# Altium schematic sheet 01_sensors.SchDoc: SENSEI Sensor Shield - Sensors
size A2; Author: Philip Wiese; DrawnBy: Philip Wiese; Engineer: Philip Wiese; Organization: Integrated System Laboratory; DocumentNumber: 1; Revision: v1.0; SheetNumber: 1; SheetTotal: 4
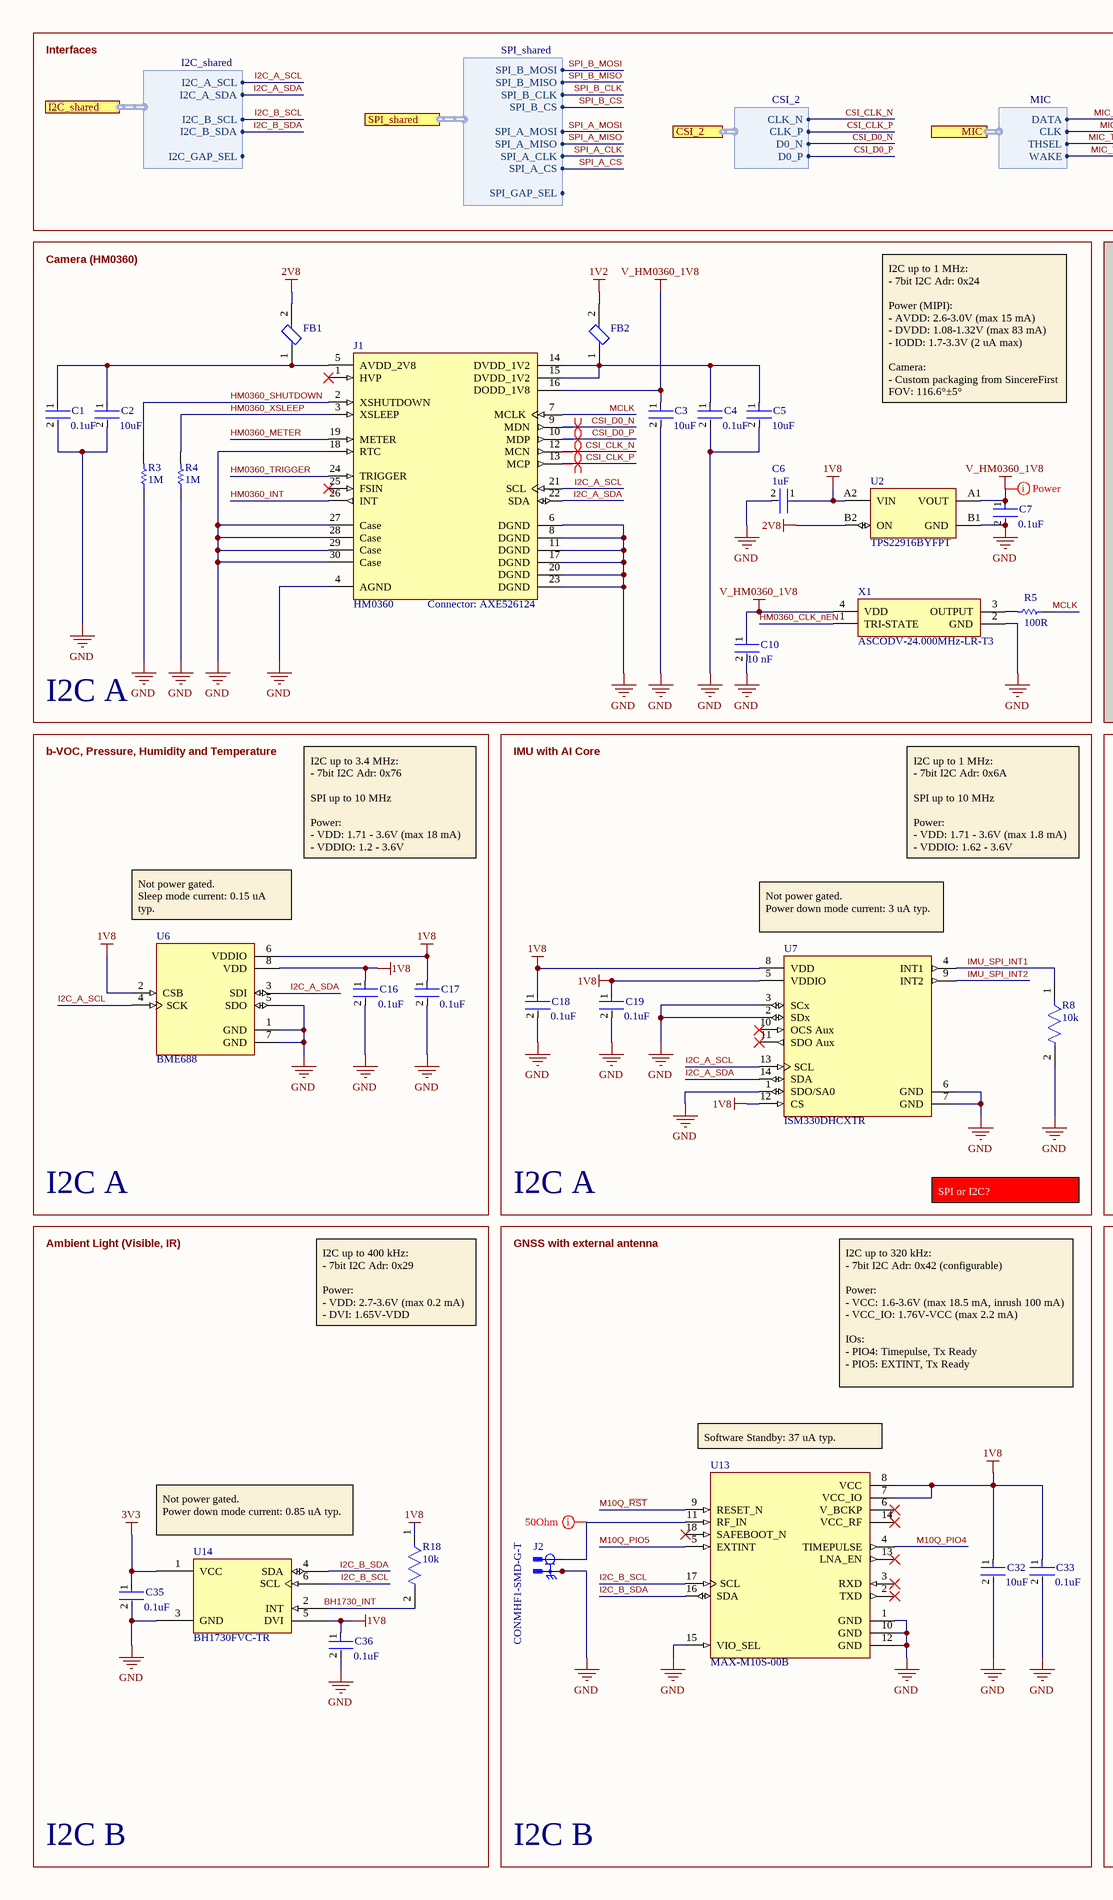
[diagram p0: 01_sensors.SchDoc, left]
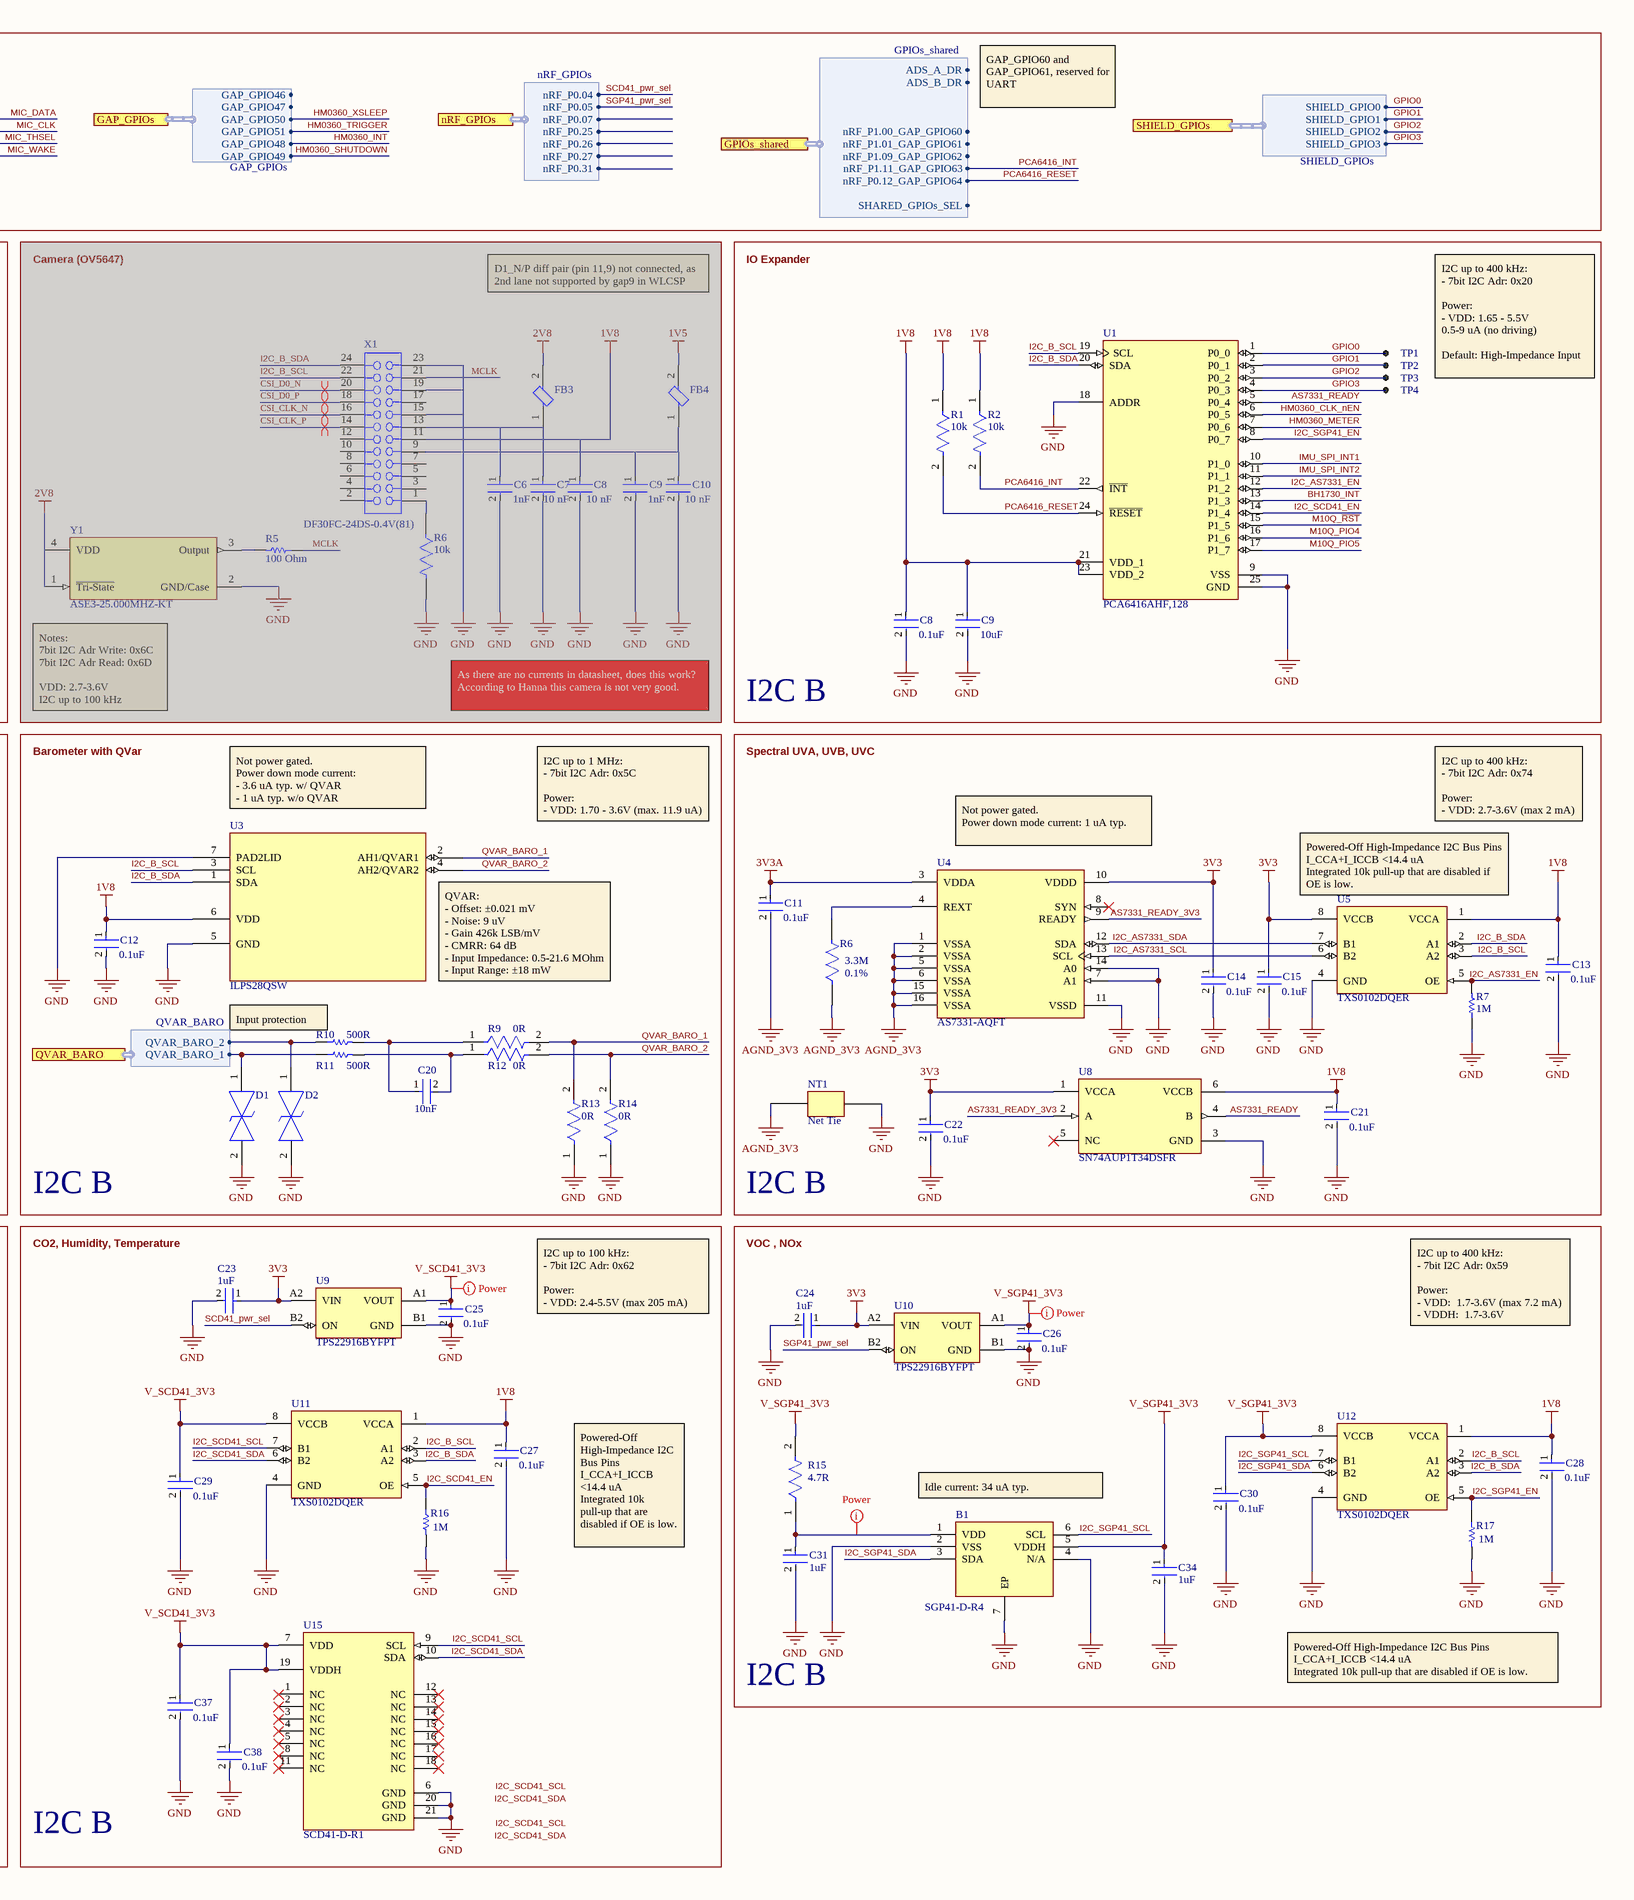
[diagram p1: 01_sensors.SchDoc, right]

## Parts
(Parts that share a designator on the sheet are numbered #1, #2 ... from top to bottom, then left to right.)
B1  SGP41-D-R4  [SON80P244X244X95-7N]
C1  Capacitance: 0.1uF  [FP-GRM033-0_03-IPC_B]  (hidden comment: GRM033Z71C104KE14D)
C2  Capacitance: 10uF  [FP-GRM155-0_2-0_1-MFG]  (hidden comment: GRM155R60G106ME47D)
C3  Capacitance: 10uF  [FP-GRM155-0_2-0_1-MFG]  (hidden comment: GRM155R60G106ME47D)
C4  Capacitance: 0.1uF  [FP-GRM033-0_03-IPC_B]  (hidden comment: GRM033Z71C104KE14D)
C5  Capacitance: 10uF  [FP-GRM155-0_2-0_1-MFG]  (hidden comment: GRM155R60G106ME47D)
C6#1  value 1nF  [FP-GRM155-0_05-IPC_B]  (hidden comment: C0402C102F5GECAUTO)  (masked out: inside a compile mask, not in the netlist)
C6#2  Capacitance: 1uF  [FP-CL03-IPC_B]  (hidden comment: CL03A105KP3NSNC)
C7#1  Capacitance: 10 nF  [FP-CC0402-MFG]  (hidden comment: CC0402KRX7R7BB103)  (masked out: inside a compile mask, not in the netlist)
C7#2  Capacitance: 0.1uF  [FP-GRM033-0_03-IPC_B]  (hidden comment: GRM033Z71C104KE14D)
C8#1  Capacitance: 10 nF  [FP-CC0402-MFG]  (hidden comment: CC0402KRX7R7BB103)  (masked out: inside a compile mask, not in the netlist)
C8#2  Capacitance: 0.1uF  [FP-GRM033-0_03-IPC_B]  (hidden comment: GRM033Z71C104KE14D)
C9#1  value 1nF  [FP-GRM155-0_05-IPC_B]  (hidden comment: C0402C102F5GECAUTO)  (masked out: inside a compile mask, not in the netlist)
C9#2  Capacitance: 10uF  [FP-GRM155-0_2-0_1-MFG]  (hidden comment: GRM155R60G106ME47D)
C10#1  Capacitance: 10 nF  [FP-CC0402-MFG]  (hidden comment: CC0402KRX7R7BB103)  (masked out: inside a compile mask, not in the netlist)
C10#2  Capacitance: 10 nF  [FP-CC0402-MFG]  (hidden comment: CC0402KRX7R7BB103)
C11  Capacitance: 0.1uF  [FP-GRM033-0_03-IPC_B]  (hidden comment: GRM033Z71C104KE14D)
C12  Capacitance: 0.1uF  [FP-GRM033-0_03-IPC_B]  (hidden comment: GRM033Z71C104KE14D)
C13  Capacitance: 0.1uF  [FP-GRM033-0_03-IPC_B]  (hidden comment: GRM033Z71C104KE14D)
C14  Capacitance: 0.1uF  [FP-GRM033-0_03-IPC_B]  (hidden comment: GRM033Z71C104KE14D)
C15  Capacitance: 0.1uF  [FP-GRM033-0_03-IPC_B]  (hidden comment: GRM033Z71C104KE14D)
C16  Capacitance: 0.1uF  [FP-GRM033-0_03-IPC_B]  (hidden comment: GRM033Z71C104KE14D)
C17  Capacitance: 0.1uF  [FP-GRM033-0_03-IPC_B]  (hidden comment: GRM033Z71C104KE14D)
C18  Capacitance: 0.1uF  [FP-GRM033-0_03-IPC_B]  (hidden comment: GRM033Z71C104KE14D)
C19  Capacitance: 0.1uF  [FP-GRM033-0_03-IPC_B]  (hidden comment: GRM033Z71C104KE14D)
C20  Capacitance: 10nF  [FP-GRM033-0_03-IPC_A]  (hidden comment: GRM033R71A103JA01D)
C21  Capacitance: 0.1uF  [FP-GRM033-0_03-IPC_B]  (hidden comment: GRM033Z71C104KE14D)
C22  Capacitance: 0.1uF  [FP-GRM033-0_03-IPC_B]  (hidden comment: GRM033Z71C104KE14D)
C23  Capacitance: 1uF  [FP-CL03-IPC_B]  (hidden comment: CL03A105KP3NSNC)
C24  Capacitance: 1uF  [FP-CL03-IPC_B]  (hidden comment: CL03A105KP3NSNC)
C25  Capacitance: 0.1uF  [FP-GRM033-0_03-IPC_B]  (hidden comment: GRM033Z71C104KE14D)
C26  Capacitance: 0.1uF  [FP-GRM033-0_03-IPC_B]  (hidden comment: GRM033Z71C104KE14D)
C27  Capacitance: 0.1uF  [FP-GRM033-0_03-IPC_B]  (hidden comment: GRM033Z71C104KE14D)
C28  Capacitance: 0.1uF  [FP-GRM033-0_03-IPC_B]  (hidden comment: GRM033Z71C104KE14D)
C29  Capacitance: 0.1uF  [FP-GRM033-0_03-IPC_B]  (hidden comment: GRM033Z71C104KE14D)
C30  Capacitance: 0.1uF  [FP-GRM033-0_03-IPC_B]  (hidden comment: GRM033Z71C104KE14D)
C31  Capacitance: 1uF  [FP-CL03-IPC_B]  (hidden comment: CL03A105KP3NSNC)
C32  Capacitance: 10uF  [FP-GRM155-0_2-0_1-MFG]  (hidden comment: GRM155R60G106ME47D)
C33  Capacitance: 0.1uF  [FP-GRM033-0_03-IPC_B]  (hidden comment: GRM033Z71C104KE14D)
C34  Capacitance: 1uF  [FP-CL03-IPC_B]  (hidden comment: CL03A105KP3NSNC)
C35  Capacitance: 0.1uF  [FP-GRM033-0_03-IPC_B]  (hidden comment: GRM033Z71C104KE14D)
C36  Capacitance: 0.1uF  [FP-GRM033-0_03-IPC_B]  (hidden comment: GRM033Z71C104KE14D)
C37  Capacitance: 0.1uF  [FP-GRM033-0_03-IPC_B]  (hidden comment: GRM033Z71C104KE14D)
C38  Capacitance: 0.1uF  [FP-GRM033-0_03-IPC_B]  (hidden comment: GRM033Z71C104KE14D)
D1  TPD1E01B04DPYRQ1  [TPD1E01B04DPYRQ1]  (value not drawn)
D2  TPD1E01B04DPYRQ1  [TPD1E01B04DPYRQ1]  (value not drawn)
FB1  BLM18HE152SN1D  [FP-BLM18-0_15-t0_8-IPC_C]  (value not drawn)
FB2  BLM18HE152SN1D  [FP-BLM18-0_15-t0_8-IPC_C]  (value not drawn)
FB3  BLM18HE152SN1D  [FP-BLM18-0_15-t0_8-IPC_C]  (value not drawn)  (masked out: inside a compile mask, not in the netlist)
FB4  BLM18HE152SN1D  [FP-BLM18-0_15-t0_8-IPC_C]  (value not drawn)  (masked out: inside a compile mask, not in the netlist)
J1  Connector: AXE526124  [AXE526124_HM0360]
J2  CONMHF1-SMD-G-T  [LINX_CONMHF1-SMD-G-T]
NT1  Net Tie  [Net_Tie_Top_Bottom0_4mm_0_2mm]  (net tie, no BOM)
R1  Resistance: 10k  [FP-RMCF0201-IPC_C]  (hidden comment: RMCF0201FT10K0)
R2  Resistance: 10k  [FP-RMCF0201-IPC_C]  (hidden comment: RMCF0201FT10K0)
R3  value 1M  [RESC0201(0603)_L]  (hidden comment: 1M 5% 0201(0603))
R4  value 1M  [RESC0201(0603)_L]  (hidden comment: 1M 5% 0201(0603))
R5#1  value 100 Ohm  [RESC1005X40X25LL05T05]  (hidden comment: ERJ-2RKF1000X)  (masked out: inside a compile mask, not in the netlist)
R5#2  Resistance: 100R  [RESC1005X40X25LL05T05]  (hidden comment: ERJ-2RKF1000X)
R6#1  Resistance: 10k  [FP-RMCF0201-IPC_C]  (hidden comment: RMCF0201FT10K0)  (masked out: inside a compile mask, not in the netlist)
R6#2  Resistance: 3.3M  Tolerance: 0.1%  [RESC2012X62N]  (hidden comment: MCU0805MD3304BP500)
R7  value 1M  [RESC0201(0603)_L]  (hidden comment: 1M 5% 0201(0603))
R8  Resistance: 10k  [FP-RMCF0201-IPC_C]  (hidden comment: RMCF0201FT10K0)
R9  Resistance: 0R  [FP-RMCF0402-IPC_A]  (hidden comment: RMCF0402ZT0R00)
R10  Resistance: 500R  [RESC0603X26X15LL03T05]  (hidden comment: ERJ-1GNF4990C)
R11  Resistance: 500R  [RESC0603X26X15LL03T05]  (hidden comment: ERJ-1GNF4990C)
R12  Resistance: 0R  [FP-RMCF0402-IPC_A]  (hidden comment: RMCF0402ZT0R00)
R13  Resistance: 0R  [FP-RMCF0402-IPC_A]  (hidden comment: RMCF0402ZT0R00)
R14  Resistance: 0R  [FP-RMCF0402-IPC_A]  (hidden comment: RMCF0402ZT0R00)
R15  Resistance: 4.7R  [FP-CRCW0402-e3-MFG]  (hidden comment: CRCW04024R70FKED)
R16  value 1M  [RESC0201(0603)_L]  (hidden comment: 1M 5% 0201(0603))
R17  value 1M  [RESC0201(0603)_L]  (hidden comment: 1M 5% 0201(0603))
R18  Resistance: 10k  [FP-RMCF0201-IPC_C]  (hidden comment: RMCF0201FT10K0)
TP1  Test Pad  [Pad-0.6mm]  (value not drawn)  (no BOM)
TP2  Test Pad  [Pad-0.6mm]  (value not drawn)  (no BOM)
TP3  Test Pad  [Pad-0.6mm]  (value not drawn)  (no BOM)
TP4  Test Pad  [Pad-0.6mm]  (value not drawn)  (no BOM)
U1  PCA6416AHF,128  [QFN50P400X400X80-25N-D]
U2  TPS22916BYFPT  [BGA4C40P2X2_77X77X50]
U3  ILPS28QSW  [LGA7_ILPS28_STM]
U4  AS7331-AQFT  [OLGA16]
U5  TXS0102DQER  [FP-DQE0008A-MFG]
U6  BME688  [IC_BME688]
U7  ISM330DHCXTR  [FP-LGA-14L-DM00249496-MFG]
U8  SN74AUP1T34DSFR  [FP-DSF0006A-MFG]
U9  TPS22916BYFPT  [BGA4C40P2X2_77X77X50]
U10  TPS22916BYFPT  [BGA4C40P2X2_77X77X50]
U11  TXS0102DQER  [FP-DQE0008A-MFG]
U12  TXS0102DQER  [FP-DQE0008A-MFG]
U13  MAX-M10S-00B  [XCVR_MAX-M8C-0-10]
U14  BH1730FVC-TR  [SON_30FVC-TR_ROM]
U15  SCD41-D-R1  [FP-SCD41-D-R1-MFG]
X1#1  DF30FC-24DS-0.4V(81)  [DF30FC-24DS-0.4V(81)]  (masked out: inside a compile mask, not in the netlist)
X1#2  ASCODV-24.000MHz-LR-T3  [ASCODV24000MHzLRT3]
Y1  ASE3-25.000MHZ-KT  [FP-ASE3-MFG]  (masked out: inside a compile mask, not in the netlist)

## Blocks framed on the sheet
I2C A: C1-C5 C6#2 C7#2 C10#2 FB1 FB2 J1 R3 R4 R5#2 U2 X1#2
Camera (OV5647): C6#1 C7#1 C8#1 C9#1 C10#1 FB3 FB4 R5#1 R6#1 X1#1 Y1
I2C B: C8#2 C9#2 R1 R2 TP1-TP4 U1
I2C A: C16 C17 U6
I2C A: C18 C19 R8 U7
I2C B: C12 C20 D1 D2 R9-R14 U3
I2C B: C11 C13-C15 C21 C22 NT1 R6#2 R7 U4 U5 U8
I2C B: C35 C36 R18 U14
I2C B: C32 C33 J2 U13
I2C B: C23 C25 C27 C29 C37 C38 R16 U9 U11 U15
I2C B: B1 C24 C26 C28 C30 C31 C34 R15 R17 U10 U12

## Ports
CSI_2 (harness CSI_2), GAP_GPIOs (harness GAP_GPIOs), GPIOs_shared (harness GPIOs_shared), I2C_shared (harness I2C_shared), MIC (harness MIC), nRF_GPIOs (harness nRF_GPIOs), QVAR_BARO (harness QVAR_BARO), SHIELD_GPIOs (harness SHIELD_GPIOs), SPI_shared (harness SPI_shared)

## Harnesses
I2C_shared: I2C_A_SCL, I2C_A_SDA, I2C_B_SCL, I2C_B_SDA, I2C_GAP_SEL
SPI_shared: SPI_B_MOSI, SPI_B_MISO, SPI_B_CLK, SPI_B_CS, SPI_A_MOSI, SPI_A_MISO, SPI_A_CLK, SPI_A_CS, SPI_GAP_SEL
MIC: DATA, THSEL, WAKE, CLK
CSI_2: CLK_N, CLK_P, D0_P, D0_N
GAP_GPIOs: GAP_GPIO46, GAP_GPIO47, GAP_GPIO50, GAP_GPIO51, GAP_GPIO48, GAP_GPIO49
nRF_GPIOs: nRF_P0.07, nRF_P0.25, nRF_P0.05, nRF_P0.04, nRF_P0.26, nRF_P0.27, nRF_P0.31
GPIOs_shared: ADS_A_DR, ADS_B_DR, nRF_P1.00_GAP_GPIO60, nRF_P1.09_GAP_GPIO62, nRF_P1.11_GAP_GPIO63, nRF_P0.12_GAP_GPIO64, SHARED_GPIOs_SEL, nRF_P1.01_GAP_GPIO61
QVAR_BARO: QVAR_BARO_2, QVAR_BARO_1
SHIELD_GPIOs: SHIELD_GPIO1, SHIELD_GPIO2, SHIELD_GPIO0, SHIELD_GPIO3

## Nets
1V2: FB2.2
1V8: C6#2.1 C8#2.1 C9#2.1 C12.1 C13.1 C16.1 C17.1 C18.1 C19.1 C21.1 C27.1 C28.1 C32.1 C33.1 C36.1 R1.1 R2.1 R18.1 U1.21(VDD_1) U1.23(VDD_2) U2.A2(VIN) U3.6(VDD) U5.1(VCCA) U6.2(CSB) U6.6(VDDIO) U6.8(VDD) U7.5(VDDIO) U7.8(VDD) U7.12(CS) U8.6(VCCB) U11.1(VCCA) U12.1(VCCA) U13.7(VCC_IO) U13.8(VCC) U14.5(DVI)
2V8: FB1.2 U2.B2(ON)
3V3: C14.1 C15.1 C22.1 C23.1 C24.1 C35.1 U4.10(VDDD) U5.8(VCCB) U8.1(VCCA) U9.A2(VIN) U10.A2(VIN) U14.1(VCC)
3V3A: C11.1 U4.3(VDDA)
AGND_3V3: C11.2 NT1.1 R6#2.1 U4.1(VSSA) U4.2(VSSA) U4.5(VSSA) U4.6(VSSA) U4.15(VSSA) U4.16(VSSA)
GND: B1.2(VSS) B1.4(N/A) B1.7(EP) C1.2 C2.2 C3.2 C4.2 C5.2 C6#2.2 C7#2.2 C8#2.2 C9#2.2 C10#2.2 C12.2 C13.2 C14.2 C15.2 C16.2 C17.2 C18.2 C19.2 C21.2 C22.2 C23.2 C24.2 C25.2 C26.2 C27.2 C28.2 C29.2 C30.2 C31.2 C32.2 C33.2 C34.2 C35.2 C36.2 C37.2 C38.2 D1.2 D2.2 J1.4(AGND) J1.6(DGND) J1.8(DGND) J1.11(DGND) J1.17(DGND) J1.18(RTC) J1.20(DGND) J1.23(DGND) J1.27(Case) J1.28(Case) J1.29(Case) J1.30(Case) J2.S1 J2.S2 J2.S3 NT1.2 R3.1 R4.1 R7.1 R8.2 R13.1 R14.1 R16.2 R17.2 U1.9(VSS) U1.18(ADDR) U1.25(GND) U2.B1(GND) U3.5(GND) U3.7(PAD2LID) U4.7(A1) U4.11(VSSD) U4.14(A0) U5.4(GND) U6.1(GND) U6.5(SDO) U6.7(GND) U7.1(SDO/SA0) U7.2(SDx) U7.3(SCx) U7.6(GND) U7.7(GND) U8.3(GND) U9.B1(GND) U10.B1(GND) U11.4(GND) U12.4(GND) U13.1(GND) U13.10(GND) U13.12(GND) U13.15(VIO_SEL) U14.3(GND) U15.6(GND) U15.20(GND) U15.21(GND) X1#2.2(GND)
V_HM0360_1V8: C3.1 C7#2.1 C10#2.1 J1.16(DODD_1V8) U2.A1(VOUT) X1#2.4(VDD)
V_SCD41_3V3: C25.1 C29.1 C37.1 C38.1 U9.A1(VOUT) U11.8(VCCB) U15.7(VDD) U15.19(VDDH)
V_SGP41_3V3: B1.5(VDDH) C26.1 C30.1 C34.1 R15.2 U10.A1(VOUT) U12.8(VCCB)
AS7331_READY: U1.5(P0_4) U8.4(B)
AS7331_READY_3V3: U4.9(READY) U8.2(A)
BH1730_INT: R18.2 U1.13(P1_3) U14.2(INT)
CSI_CLK_N: J1.12(MCN) ; port CSI_2.CLK_N
CSI_CLK_P: J1.13(MCP) ; port CSI_2.CLK_P
CSI_D0_N: J1.9(MDN) ; port CSI_2.D0_N
CSI_D0_P: J1.10(MDP) ; port CSI_2.D0_P
GPIO0: TP1.1 U1.1(P0_0) ; port SHIELD_GPIOs.SHIELD_GPIO0
GPIO1: TP2.1 U1.2(P0_1) ; port SHIELD_GPIOs.SHIELD_GPIO1
GPIO2: TP3.1 U1.3(P0_2) ; port SHIELD_GPIOs.SHIELD_GPIO2
GPIO3: TP4.1 U1.4(P0_3) ; port SHIELD_GPIOs.SHIELD_GPIO3
HM0360_CLK_nEN: U1.6(P0_5) X1#2.1(TRI-STATE)
HM0360_INT: J1.26(INT) ; port GAP_GPIOs.GAP_GPIO48
HM0360_METER: J1.19(METER) U1.7(P0_6)
HM0360_SHUTDOWN: J1.2(XSHUTDOWN) R3.2 ; port GAP_GPIOs.GAP_GPIO49
HM0360_TRIGGER: J1.24(TRIGGER) ; port GAP_GPIOs.GAP_GPIO51
HM0360_XSLEEP: J1.3(XSLEEP) R4.2 ; port GAP_GPIOs.GAP_GPIO50
I2C_A_SCL: J1.21(SCL) U6.4(SCK) U7.13(SCL) ; port I2C_shared.I2C_A_SCL
I2C_A_SDA: J1.22(SDA) U6.3(SDI) U7.14(SDA) ; port I2C_shared.I2C_A_SDA
I2C_AS7331_EN: R7.2 U1.12(P1_2) U5.5(OE)
I2C_AS7331_SCL: U4.13(SCL) U5.6(B2)
I2C_AS7331_SDA: U4.12(SDA) U5.7(B1)
I2C_B_SCL: U1.19(SCL) U3.3(SCL) U5.3(A2) U11.2(A1) U12.2(A1) U13.17(SCL) U14.6(SCL) ; port I2C_shared.I2C_B_SCL
I2C_B_SDA: U1.20(SDA) U3.1(SDA) U5.2(A1) U11.3(A2) U12.3(A2) U13.16(SDA) U14.4(SDA) ; port I2C_shared.I2C_B_SDA
I2C_SCD41_EN: R16.1 U1.14(P1_4) U11.5(OE)
I2C_SCD41_SCL: U11.7(B1) U15.9(SCL)
I2C_SCD41_SDA: U11.6(B2) U15.10(SDA)
I2C_SGP41_EN: R17.1 U1.8(P0_7) U12.5(OE)
I2C_SGP41_SCL: B1.6(SCL) U12.7(B1)
I2C_SGP41_SDA: B1.3(SDA) U12.6(B2)
IMU_SPI_INT1: R8.1 U1.10(P1_0) U7.4(INT1)
IMU_SPI_INT2: U1.11(P1_1) U7.9(INT2)
M10Q_PIO4: U1.16(P1_6) U13.4(TIMEPULSE)
M10Q_PIO5: U1.17(P1_7) U13.5(EXTINT)
M10Q_~{RST}: U1.15(P1_5) U13.9(RESET_N)
MCLK: J1.7(MCLK) R5#2.1
MIC_CLK: port MIC.CLK
MIC_DATA: port MIC.DATA
MIC_THSEL: port MIC.THSEL
MIC_WAKE: port MIC.WAKE
PCA6416_INT: R2.2 U1.22(~{INT}) ; port GPIOs_shared.nRF_P1.11_GAP_GPIO63
PCA6416_RESET: R1.2 U1.24(~{RESET}) ; port GPIOs_shared.nRF_P0.12_GAP_GPIO64
QVAR_BARO_1: R9.2 R13.2 U3.2(AH1/QVAR1)
QVAR_BARO_2: R12.2 R14.2 U3.4(AH2/QVAR2)
SCD41_pwr_sel: U9.B2(ON) ; port nRF_GPIOs.nRF_P0.04
SGP41_pwr_sel: U10.B2(ON) ; port nRF_GPIOs.nRF_P0.05
SPI_A_CLK: port SPI_shared.SPI_A_CLK
SPI_A_CS: port SPI_shared.SPI_A_CS
SPI_A_MISO: port SPI_shared.SPI_A_MISO
SPI_A_MOSI: port SPI_shared.SPI_A_MOSI
SPI_B_CLK: port SPI_shared.SPI_B_CLK
SPI_B_CS: port SPI_shared.SPI_B_CS
SPI_B_MISO: port SPI_shared.SPI_B_MISO
SPI_B_MOSI: port SPI_shared.SPI_B_MOSI
NetB1_1: B1.1(VDD) C31.1 R15.1
NetC1_1: C1.1 C2.1 FB1.1 J1.5(AVDD_2V8)
NetC4_1: C4.1 C5.1 FB2.1 J1.14(DVDD_1V2) J1.15(DVDD_1V2)
NetC20_1: C20.1 R9.1 R10.2
NetC20_2: C20.2 R11.2 R12.1
NetD1_1: D1.1 R11.1 ; port QVAR_BARO.QVAR_BARO_1
NetD2_1: D2.1 R10.1 ; port QVAR_BARO.QVAR_BARO_2
NetJ2_1: J2.1 U13.11(RF_IN)
NetR5#2_2: R5#2.2 X1#2.3(OUTPUT)
NetR6#2_2: R6#2.2 U4.4(REXT)

Not connected (* = marked no-connect by the designer): J1 1(HVP)* 25(FSIN)*; U4 8(SYN)*; U7 10(OCS_Aux)* 11(SDO_Aux)*; U8 5(NC)*; U13 2(TXD)* 3(RXD)* 6(V_BCKP)* 13(LNA_EN)* 14(VCC_RF)* 18(SAFEBOOT_N)*; U15 1(NC)* 2(NC)* 3(NC)* 4(NC)* 5(NC)* 8(NC)* 11(NC)* 12(NC)* 13(NC)* 14(NC)* 15(NC)* 16(NC)* 17(NC)* 18(NC)*

## Layout directives
differential pair: (no net found under the mark)
differential pair; differential pair class 100Ohm: CSI_CLK_N, CSI_CLK_P, CSI_D0_N, CSI_D0_P
rule Routing Corners [Style = Round    Min Setback = 100mil    Max Setback = 100mil]; net class 50Ohm: NetJ2_1
net class Power: NetB1_1, V_HM0360_1V8, V_SCD41_3V3, V_SGP41_3V3

## Notes on the sheet
- Interfaces
- GAP_GPIO60 and GAP_GPIO61, reserved for UART
- Camera (HM0360)
- IO Expander
- D1_N/P diff pair (pin 11,9) not connected, as 2nd lane not supported by gap9 in WLCSP
- I2C up to 1 MHz:
  - 7bit I2C Adr: 0x24
  Power (MIPI):
  - AVDD: 2.6-3.0V (max 15 mA)
  - DVDD: 1.08-1.32V (max 83 mA)
  - IODD: 1.7-3.3V (2 uA max)
  Camera:
  - Custom packaging from SincereFirst
  FOV: 116.6°±5°
- I2C up to 400 kHz:
  - 7bit I2C Adr: 0x20
  Power:
  - VDD: 1.65 - 5.5V
  0.5-9 uA (no driving)
  Default: High-Impedance Input
- (near Y1) Notes:
  7bit I2C Adr Write: 0x6C
  7bit I2C Adr Read: 0x6D
  VDD: 2.7-3.6V
  I2C up to 100 kHz
- As there are no currents in datasheet, does this work?
  According to Hanna this camera is not very good.
- b-VOC, Pressure, Humidity and Temperature
- IMU with AI Core
- Barometer with QVar
- Spectral UVA, UVB, UVC
- Not power gated.
  Power down mode current:
  - 3.6 uA typ. w/ QVAR
  - 1 uA typ. w/o QVAR
- I2C up to 1 MHz:
  - 7bit I2C Adr: 0x5C
  Power:
  - VDD: 1.70 - 3.6V (max. 11.9 uA)
- I2C up to 400 kHz:
  - 7bit I2C Adr: 0x74
  Power:
  - VDD: 2.7-3.6V (max 2 mA)
- I2C up to 3.4 MHz:
  - 7bit I2C Adr: 0x76
  SPI up to 10 MHz
  Power:
  - VDD: 1.71 - 3.6V (max 18 mA)
  - VDDIO: 1.2 - 3.6V
- I2C up to 1 MHz:
  - 7bit I2C Adr: 0x6A
  SPI up to 10 MHz
  Power:
  - VDD: 1.71 - 3.6V (max 1.8 mA)
  - VDDIO: 1.62 - 3.6V
- (near U4) Not power gated.
  Power down mode current: 1 uA typ.
- (near U5) Powered-Off High-Impedance I2C Bus Pins
  I_CCA+I_ICCB <14.4 uA
  Integrated 10k pull-up that are disabled if OE is low.
- (near U6) Not power gated.
  Sleep mode current: 0.15 uA typ.
- (near U7) Not power gated.
  Power down mode current: 3 uA typ.
- (near U3) QVAR:
  - Offset: ±0.021 mV
  - Noise: 9 uV
  - Gain 426k LSB/mV
  - CMRR: 64 dB
  - Input Impedance: 0.5-21.6 MOhm
  - Input Range: ±18 mW
- (near R10) Input protection
- SPI or I2C?
- Ambient Light (Visible, IR)
- GNSS with external antenna
- CO2, Humidity, Temperature
- VOC , NOx
- I2C up to 400 kHz:
  - 7bit I2C Adr: 0x29
  Power:
  - VDD: 2.7-3.6V (max 0.2 mA)
  - DVI: 1.65V-VDD
- I2C up to 100 kHz:
  - 7bit I2C Adr: 0x62
  Power:
  - VDD: 2.4-5.5V (max 205 mA)
- I2C up to 400 kHz:
  - 7bit I2C Adr: 0x59
  Power:
  - VDD:  1.7-3.6V (max 7.2 mA)
  - VDDH:  1.7-3.6V
- I2C up to 320 kHz:
  - 7bit I2C Adr: 0x42 (configurable)
  Power:
  - VCC: 1.6-3.6V (max 18.5 mA, inrush 100 mA)
  - VCC_IO: 1.76V-VCC (max 2.2 mA)
  IOs:
  - PIO4: Timepulse, Tx Ready
  - PIO5: EXTINT, Tx Ready
- (near U13) Software Standby: 37 uA typ.
- (near B1) Idle current: 34 uA typ.
- (near U14) Not power gated.
  Power down mode current: 0.85 uA typ.
- Powered-Off High-Impedance I2C Bus Pins
  I_CCA+I_ICCB <14.4 uA
  Integrated 10k pull-up that are disabled if OE is low.
- Labels drawn without touching a wire or pin: I2C_SCD41_SCL, I2C_SCD41_SDA
- Drawing title:
- Drawing number:
- Rev:
- Format:
- Laboratory:
- Project:
- File:
- Date:
- A2
- Drawn by:
- Page
- of

## Library data of the parts
B1 = SGP41-D-R4: Air Quality Sensors VOC and NOx (MOX) Gas Pollutant Sensor; Manufacturer_Name: Sensirion; Geometry.Height: 0.95mm; Mouser Part Number: 403-SGP41-D-R4; Mouser Price/Stock: https://www.mouser.co.uk/ProductDetail/Sensirion/SGP41-D-R4?qs=A6eO%252BMLsxmRqwfOE5NYPVA%3D%3D; Manufacturer_Part_Number: SGP41-D-R4; Datasheet Link: https://www.sensirion.com/fileadmin/user_upload/customers/sensirion/Dokumente/9_Gas_Sensors/Datasheets/Sensirion_Gas_Sensors_Datasheet_SGP41.pdf
C1 C4 C7#2 C8#2 C11-C19 C21 C22 C25-C30 C33 C35-C38 = CMP-06035-035508-1: Chip Multilayer Ceramic Capacitors for General Purpose, 0201, 0.10uF, X7R, 15%, 10%, 16V; Case/Package: 0201; Tolerance: 15%
C2 C3 C5 C9#2 C32 = CMP-06035-039936-1: Chip Multilayer Ceramic Capacitors for General Purpose, 0402, 10uF, X5R, 15%, 20%, 4V; Width: 0.02inch; Case Code (Metric): 1005; Case Code (Imperial): 0402; Voltage Rating: 4V; Length: 0.039inch; Max Operating Temperature: 85°C; Case/Package: 0402; Voltage Rating (DC): 4V; Mount: Surface Mount; Min Operating Temperature: -55°C; Dielectric: X5R; Thickness: 0.024inch; Packaging: Tape and Reel; Tolerance: 20%
C6#1 C9#1 = CMP-2008-04254-2: Chip Multilayer Ceramic Capacitors for General Purpose, 0402, 1000pF, C0G, 30ppm/°C, 5%, 50V; Insulation Resistance: 10GR; Packaging: Tape and Reel; Lead Free: Lead Free; Tolerance: 5%; Temperature Coefficient: 30ppm/°C; Thickness: 0.022inch; Termination: SMD/SMT; Max Operating Temperature: 125°C; Height: 0.5mm; Package Quantity: 1; Radiation Hardening: No; Material: Ceramic; Case Code (Metric): 1005; Number of Pins: 2; Voltage Rating: 50V; Mount: Surface Mount; Voltage: 50V; Case/Package: 0402; Min Operating Temperature: -55°C; Dielectric Material: Ceramic; Width: 0.5mm; Depth: 0.5mm; Case Code (Imperial): 0402; REACH SVHC: No SVHC; Dielectric: C0G; Capacitance: 1nF; Voltage Rating (DC): 50V; Length: 1mm
C6#2 C23 C24 C31 C34 = CMP-13271-003594-1: Cap Ceramic 1uF 10V X5R ±10% Pad SMD 0201 +85°C T/R; Min Operating Temperature: -55°C; Mount: Surface Mount; Packaging: Cut Tape; Width: 0.012inch; Tolerance: 10%; Case Code (Imperial): 0201; Thickness: 0.013inch; Length: 0.024inch; Case/Package: 0201; Max Operating Temperature: 85°C; Voltage Rating: 10V; Case Code (Metric): 0603
C7#1 C8#1 C10#1 C10#2 = CMP-03422-000501-1: CAP CER 10000PF 16V X7R 0402; Manufacturer: YAGEO; Automotive Grade: NA; Material: Ceramic; Value: 10 nF; Tolerance: 0.1; Temperature Coefficient: 30ppm/°C; Temperature Range Low: -55°C; Temperature Range High: +125°C; Mouser Description: 0402 10 nF 16 V ±10 % Tolerance X7R SMT Multilayer Ceramic Capacitor; Footprint Url: http://www.yageo.com/exep/pages/download/literatures/UPY-C_GEN_24.pdf; Category: Cap; RoHS: TRUE; Manufacturer Part Number: CC0402KRX7R7BB103; ComponentLink2Description: Datasheet; Ipc Land Pattern Name: CAPC10050X50; Automotive: No; ComponentLink2URL: http://www.yageo.com/documents/recent/UPY-GP_NP0_16V-to-50V_16.pdf; Device Class L1: Passive Components; Height: 0.55mm; Temperature Characteristic: X7R; Package: CC0402; Voltage Rating: 16 V; Device Class L3: Ceramic Capacitors; Lead Free: Yes; Device Class L2: Capacitors; Digikey Description: CAP CER 10000PF 16V X7R 0402; Octopart: https://octopart.com/cc0402krx7r7bb103-yageo-192895; Temperature: -55°C to +125°C
C20 = CMP-06035-055566-1: Chip Multilayer Ceramic Capacitors for General Purpose, 0201, 10000pF, X7R, 15%, 5%, 10V; Tolerance: 5%; Width: 300um; Length: 600um; Dielectric: X7R; Thickness: 300um; Voltage Rating (DC): 10V
D1 D2 = TPD1E01B04DPYRQ1: TVS Diode (Bi-directional); Manufacturer_Name: Texas Instruments; Datasheet Link: https://www.ti.com/lit/ds/symlink/tpd1e01b04-q1.pdf?ts=1677834076075&ref_url=https%253A%252F%252Fwww.ti.com%252Fproduct%252FTPD1E01B04-Q1%252Fpart-details%252FTPD1E01B04DPYRQ1; Height: 0.45mm; Manufacturer_Part_Number: TPD1E01B04DPYRQ1; Mouser Part Number: 595-TPD1E01B04DPYRQ1; Mouser Price/Stock: https://www.mouser.co.uk/ProductDetail/Texas-Instruments/TPD1E01B04DPYRQ1?qs=doiCPypUmgEwTnvBpZhkOw%3D%3D; Arrow Part Number: TPD1E01B04DPYRQ1; Arrow Price/Stock: https://www.arrow.com/en/products/tpd1e01b04dpyrq1/texas-instruments?region=nac
FB1 FB2 = CMP-0686-00368-3: Chip Ferrite Bead, 0603, 1500Ω @ 100MHz, 0.5Ω, 25%, 500mA; Impedance: 1.5kR; DC Resistance (DCR): 500mR; Number of Circuits: 1; Test Frequency: 100MHz; Case/Package: 0603; Max Operating Temperature: 125°C; Package Quantity: 1; Max DC Current: 500mA; Tolerance: 25%; Core Material: Ferrite; Width: 0.8mm; Number of Pins: 2; Depth: 0.8mm; Radiation Hardening: No; Case Code (Imperial): 0603; Min Operating Temperature: -55°C; Termination: SMD/SMT; Material: Ferrite; Military Standard: Not; Number of Lines: 1; DC Current: 500mA; Length: 1.6mm; REACH SVHC: No SVHC; Lead Free: Lead Free; Current Rating: 500mA; Max Current Rating: 500mA; Packaging: Tape and Reel; Case Code (Metric): 1608; Height: 0.8mm
FB3 FB4 = CMP-0686-00368-3: Chip Ferrite Bead, 0603, 1500Ω @ 100MHz, 0.5Ω, 25%, 500mA; Impedance: 1.5kR; DC Resistance (DCR): 500mR; Number of Circuits: 1; value: 1.5 kOhms; Test Frequency: 100MHz; Case/Package: 0603; Max Operating Temperature: 125°C; Package Quantity: 1; Max DC Current: 500mA; Tolerance: 25%; Core Material: Ferrite; Width: 0.8mm; Number of Pins: 2; Depth: 0.8mm; Radiation Hardening: No; Case Code (Imperial): 0603; Min Operating Temperature: -55°C; Termination: SMD/SMT; Material: Ferrite; Military Standard: Not; Number of Lines: 1; DC Current: 500mA; Length: 1.6mm; REACH SVHC: No SVHC; Lead Free: Lead Free; Current Rating: 500mA; Max Current Rating: 500mA; Packaging: Tape and Reel; Case Code (Metric): 1608; Height: 0.8mm
J1 = HM0360: FFC/FPC Connector, 26 Contact(s), 2 Row(s), Female, Straight, Surface Mount Terminal, Socket; Manufacturer: Panasonic; Connector Type: CARD EDGE CONNECTOR; Option: General Purpose; Filter Feature: No; Mating Information: MULTIPLE MATING PARTS AVAILABLE; Number of Rows Loaded: 2; Number of Contacts: 26; Manufacturer Part Number: AXE526124; RoHS: Yes; Category: Connectors; Mount: Board; Contact Material: Copper Alloy; Contact Finish - Mating: GOLD OVER NICKEL; Contact Finish - Termination: Gold (Au) - with Nickel (Ni) barrier; JESD-609 Code: e4; Body/Shell Style: SOCKET; Contact Gender: Female; Mixed Contacts: No; Mounting Style: STRAIGHT; Termination: SMD/SMT; Terminal Pitch: 0.4mm; Flammability Rating: UL94 V-0; DIN Conformance: No; IEC Conformance: No; MIL Conformance: No; Reach SVHC Compliant: Yes; RoHS Compliant: Yes; Camera: HM0360
J2 = CONMHF1-SMD-G-T: U.FL/MHF1 Jack 50 Ohm PCB Surface Mount; MF: Linx Technologies Inc.; SnapEDA_Link: https://www.snapeda.com/parts/CONMHF1-SMD-G-T/Linx/view-part/?ref=snap; Package: None; Value: *; MP: CONMHF1-SMD-G-T; Check_prices: https://www.snapeda.com/parts/CONMHF1-SMD-G-T/Linx/view-part/?ref=eda
NT1 = Net_Tie_0_2_mm_0_4_mm
R1 R2 R6#1 R8 R18 = CMP-26527-002755-1: RES 10K OHM 1% 1/20W 0201; Max Power Dissipation: 50mW; Temperature Coefficient: 200ppm/°C; Length: 0.024inch; Min Operating Temperature: -55°C; Width: 0.012inch; Contact Plating: Tin; Case/Package: 0201; Power Rating: 50mW; Packaging: Tape and Reel; Resistor Type: Thick Film; Case Code (Metric): 0603; Tolerance: 1%; Case Code (Imperial): 0201; Max Operating Temperature: 125°C; Height: 0.009inch; Mount: Surface Mount; Series: RMCF; RoHS Compliant: Yes; Number of Terminations: 2
R3 R4 R7 R16 R17 = CMP-1010-00146-1: 1M 0.05W 5% 0201 (0603 Metric)  SMD; Case-Metric: 0603; Case-EIA: 0201; Technology: SMT; Tolerance: 5 %; Power: 0.05 W; Resistance: 1M
R5#1 R5#2 = CMP-2002-00605-3: Chip Resistor, 100 Ohm, +/- 1%, 100 mW, -55 to 155 degC, 0402 (1005 Metric), RoHS, Tape and Reel; Manufacturer: Basic Passives; Power Rating: 100 mW; Voltage Rating: 50 V; Case\/Package: 0402; Width: 0.5 mm; Pins: 2; ComponentLink2Description: Datasheet; PackageReference: 0402; Height: 0.35 mm; Tolerance: 1%; DatasheetVersion: 04/2015; Case Code (Imperial): 0402; Min Operating Temperature: -55 degC; Radiation Hardening: No; Length: 1 mm; Package Quantity: 10000; PackageDescription: 2-Pin Surface Mount Device, Body 1 x 0.5 mm; Mounting Technology: Surface Mount; Case Code (Metric): 1005; Packaging: Tape and Reel; ComponentLink1URL: http://www.panasonic.com/; RoHSCompliant: true; Max Operating Temperature: 155 degC; REACH SVHC: Yes; PartNumber: ERJ-2RKF1000X; ComponentLink1Description: Manufacturer URL; ComponentLink2URL: http://industrial.panasonic.com/cdbs/www-data/pdf/RDA0000/AOA0000C86.pdf; Mount: Surface Mount
  R5#1: Resistance: 100 Ohm
R6#2 = MCU0805MD3304BP500: 3.3M Ohm .1% 25PPM 1/8W; Manufacturer_Name: Vishay; Manufacturer: Vishay BCcomponents; Geometry.Height: 0.62mm; Mouser Part Number: 594-MCU0805MD3304BP5; Mouser Price/Stock: https://www.mouser.co.uk/ProductDetail/Vishay-Beyschlag/MCU0805MD3304BP500?qs=A6eO%252BMLsxmSZlVWVx087zg%3D%3D; Manufacturer_Part_Number: MCU0805MD3304BP500; Datasheet Link: https://www.mouser.in/datasheet/2/427/mc_at_precision-1762846.pdf; Manufacturer Part Number: MCU0805MD3304BP500; RoHS: No; Category: Chip SMD Resistors
R9 R12-R14 = CMP-26527-007617-1: RES 0 OHM JUMPER 1/16W 0402; Power Rating: 63mW; Working Voltage: 50V; Current Rating: 1A; Series: RMCF; RoHS Compliant: Yes; Features: Automotive AEC-Q200; Width: 0.02inch; Depth: 0.5mm; Resistor Type: Thick Film; Number of Terminations: 2; Radiation Hardening: No; Length: 0.039inch; Contact Plating: Tin; Case/Package: 0402; Min Operating Temperature: -55°C; Case Code (Metric): 1005; Construction: Rectangular; Mount: Surface Mount; Max Operating Temperature: 155°C; Max Power Dissipation: 63mW; Height: 0.016inch; Lead Free: Lead Free; Packaging: Tape and Reel; Technology: THICK FILM; Case Code (Imperial): 0402; Military Standard: Not
R10 R11 = CMP-2004-03369-1: Thick Film Resistors - SMD 0201 499ohm 1% HalogenFree AEC-Q200; Manufacturer: Panasonic; Part Number: ERJ-1GNF4990C; Tolerance: 1%
R15 = CMP-1011-00247-3: RES Thick Film, 4.7Ω, 1%, 0.063W, 100ppm/°C, 0402; Max Power Dissipation: 63mW; Voltage Rating: 50V; Tolerance: 1%; Temperature Coefficient: 100ppm/°C; Military Standard: Not; Width: 0.02inch; Length: 1mm; Number of Pins: 2; Case Code (Metric): 1005; Height: 0.016inch; Weight: 2.3E-05oz; Packaging: Tape and Reel; Composition: Thick Film; Depth: 0.5mm; Min Operating Temperature: -55°C; Number of Terminations: 2; Power Rating: 63mW; Package Quantity: 10; Features: Automotive AEC-Q200; Radiation Hardening: No; Case Code (Imperial): 0402; Contact Plating: Tin; Case/Package: 0402; Max Operating Temperature: 155°C
TP1-TP4 = CMP-00224-2: 0.6mm SMT Test Pad; Mounting Technology: SMT
U1 = PCA6416AHF_128: Parallel I/O Port, 16-Bit, 16 I/O, CMOS, PQCC24; Manufacturer_Name: NXP; Manufacturer: NXP Semiconductors; Geometry.Height: 0.8mm; Package Body Material: Plastic; Number of I/O Lines: 16; Number of Ports: 2; Max Supply Voltage: 5.5V; Min Supply Voltage: 1.65V; Supply Voltage-Nom: 1.8V; Package Equivalence Code: LCC24,.16SQ,20; Power Supplies: 1.8/5V; Qualification Status: Not Qualified; Mouser Part Number: 771-PCA6416AHF,128; Mouser Price/Stock: https://www.mouser.co.uk/ProductDetail/NXP-Semiconductors/PCA6416AHF128?qs=O0BhuZj9WkwU5QGYRyX1YQ%3D%3D; Manufacturer_Part_Number: PCA6416AHF,128; Datasheet Link: http://www.nxp.com/docs/en/data-sheet/PCA6416A.pdf; Supplier 1: Farnell; Manufacturer Part Number: PCA6416AHF,128; RoHS: Yes; Category: Interface ICs; Stock 1: 2757; Pricing 1: 1=1.64, 10=1.34, 50=1.19, 100=1.04, 250=0.978, 500=0.857, 1000=0.711, 2500=0.662 (CHF); Package Code: HVQCCN; Number of Pins: 24; Package Shape: Square; Min Operating Temperature: -40°C; Max Operating Temperature: 85°C; Package Style: CHIP CARRIER, HEAT SINK/SLUG, VERY THIN PROFILEMeter; Surface Mount: Yes; Technology: CMOS; Terminal Form: No Lead; Terminal Position: QUAD; Moisture Sensitivity Level: 1; Number of Bits: 16; Length: 4mm; Width: 4mm; Height - Seated (Max): 0.8mm; Terminal Pitch: 0.5mm; Temperature Grade: INDUSTRIAL; Reach SVHC Compliant: Yes; RoHS Compliant: Yes; ComponentLink1URL: https://datasheet.ciiva.com:443/pdfs/VipMasterIC/IC/PHGL/PHGLS25934/PHGLS25934-1.pdf?src-supplier=IHS+Markit; ComponentLink1Description: https://datasheet.ciiva.com:443/pdfs/VipMasterIC/IC/PHGL/PHGLS25934/PHGLS25934-1.pdf?src-supplier=IHS+Markit; ComponentLink2URL: https://datasheet.ciiva.com/12072/pca6416a-12072630.pdf?src-supplier=Mouser; ComponentLink2Description: https://datasheet.ciiva.com/12072/pca6416a-12072630.pdf?src-supplier=Mouser; ComponentLink3URL: https://datasheet.ciiva.com/6633/pca6416a-6633097.pdf?src-supplier=Digikey; ComponentLink3Description: https://datasheet.ciiva.com/6633/pca6416a-6633097.pdf?src-supplier=Digikey; ComponentLink4URL: https://datasheet.ciiva.com/6633/pca6416a-6633101.pdf?src-supplier=Digikey; ComponentLink4Description: https://datasheet.ciiva.com/6633/pca6416a-6633101.pdf?src-supplier=Digikey; ComponentLink5URL: https://datasheet.ciiva.com/6633/pca6416a-6633099.pdf?src-supplier=Digikey; ComponentLink5Description: https://datasheet.ciiva.com/6633/pca6416a-6633099.pdf?src-supplier=Digikey; Supplier Part Number 1: 2776177
U2 U9 U10 = TPS22916BYFPT: 5.5-V, 2-A, 60-m?, 10-nA leakage load switch with output discharge 4-DSBGA -40 to 85; MF: Texas Instruments; Value: *; Package: DSBGA-4 Texas Instruments; Purchase-URL: https://pricing.snapeda.com/search/part/TPS22916BYFPT/?ref=eda; MP: TPS22916BYFPT; Price: None; SnapEDA_Link: https://www.snapeda.com/parts/TPS22916BYFPT/Texas%20Instruments/view-part/1499005/?ref=snap; Availability: Warning; Supplier 1: Mouser; Supplier Part Number 1: 595-TPS22916CYFPR
U3 = ILPS28QSW: No Description Available; Mfr_Name: STMicroelectronics; Manufacturer_Part_Number: ILPS28QSWTR; Copyright: Copyright (C) 2023 Ultra Librarian. All rights reserved.; RefDes: RefDes; Type: DEV; Supplier 1: Mouser; Supplier Part Number 1: 511-ILPS28QSWTR
U4 = AS7331-AQFT: 3-Channel UV-A/B/C Spectral Sensor-ICs; Manufacturer_Name: ams OSRAM; Geometry.Height: 1.1mm; Mouser Part Number: 985-AS7331TOLGA16LFT; Mouser Price/Stock: https://www.mouser.ch/ProductDetail/ams-OSRAM/AS7331-AQFT?qs=rQFj71Wb1eWlOxzFWeDWjA%3D%3D; Manufacturer_Part_Number: AS7331-AQFT; Datasheet Link: https://ams.com/documents/20143/9106314/AS7331_DS001047_4-00.pdf; Supplier 1: Mouser; Supplier Part Number 1: 985-AS7331TOLGA16LFT
U5 U11 U12 = CMP-04899-000003-1: IC TRNSLTR BIDIRECTIONAL 8X2SON; Manufacturer: Texas Instruments; Min Supply Voltage: 1.65V; Number Of Outputs: 2; Propagation Delay: 28ns; Number Of Circuits: 1; V A Min: 1.25V; V A Max: 3.6V; Standoff Height: 0mm; V B Min: 2.3V; Max Supply Voltage: 5.5V; Max Junction Temp: +150°C; Logic Function Desc: Non-Inverting; Data Rate: 24Mbits/s; Nominal Supply Current: 14.4uA; Device Class L1: Integrated Circuits (ICs); Temperature Range Low: -40°C; Ipc Land Pattern Name: DFN140X100X37-8; RoHS: TRUE; Package: DQE0008A; Automotive: No; Digikey Description: IC TRNSLTR BIDIRECTIONAL 8X2SON; Device Class L3: Voltage Level Shifters; Octopart: https://octopart.com/txs0102dqer-texas+instruments-19973770; ComponentLink2URL: http://www.ti.com/lit/ds/symlink/txs0102.pdf; Number Of Inputs: 2; Height: 0.4mm; ComponentLink2Description: Datasheet; Ambient Temperature Range Low: -40°C; Ambient Temperature Range High: +85°C; Temperature Range High: +85°C; Mouser Description: Translation - Voltage Levels 2B Bidirec Vltg-Lev Translator; Temperature: -40°C to +85°C; Lead Free: Yes; Device Class L2: Logic ICs; Category: IC; Manufacturer Part Number: TXS0102DQER; V B Max: 5.5V
U6 = BME688: Gas sensor measuring relative humidity, barometric pressure, ambient temperature and gas (VOC); Package: None; MP: BME688; Price: None; Availability: Unavailable; Value: *; Supplier 1: Digi-Key; Supplier Part Number 1: 828-BME688CT-ND
U7 = CMP-12177-000014-1: INEMO INERTIAL MODULE: ALWAYS-ON
U8 = CMP-0859-00946-4: IC TRNSLTR UNIDIRECTIONAL 6SON; Quiescent Current: 500nA; Number of Channels: 1; High Level Output Current: -6mA; Max Supply Voltage: 3.6V; Logic Function: Translator; Low Level Output Current: 6mA; Propagation Delay: 3.6ns; Output Type: Voltage; Min Supply Voltage: 900mV; Max Operating Temperature: 85°C; Lead Free: Lead Free; Package Quantity: 5000; Number of Circuits: 1; Case/Package: SON; Min Operating Temperature: -40°C; Radiation Hardening: No; Contact Plating: Gold; Technology: CMOS; RoHS Compliant: Yes; Mount: Surface Mount; Number of Pins: 6; Channel Type: Unidirectional; Series: 74AUP; Packaging: Tape and Reel; Number of Bits: 1
U13 = MAX-M10S-00B: u-blox M10 GNSS module ROM, TCXO, LNA, SAW LCC, 9.7x10 mm, 500 pcs/reel; Geometry.Height: 6.8mm; Mouser Part Number: 377-SAM-M10Q-00B; Mouser Price/Stock: https://www.mouser.ch/ProductDetail/u-blox/MAX-M10S-00B?qs=A6eO%252BMLsxmT0PfQYPb7LLQ%3D%3D; Manufacturer_Name: U-Blox; Manufacturer_Part_Number: MAX-M10S-00B; Datasheet Link: https://content.u-blox.com/sites/default/files/MAX-M10S_DataSheet_UBX-20035208.pdf; Supplier 1: Digikey; Supplier Part Number 1: 672-MAX-M10S-00BCT-ND
U14 = BH1730FVC-TR: Digital output type ambient light sensor IC is composed of photodiodes, current-voltage converter circuit, A / D converter, control logic circuits, interface circuits and etc. It connects with I²C Bus in an equipment; Mfr_Name: ROHM Semiconductor; Copyright: Copyright (C) 2024 Ultra Librarian. All rights reserved.; Manufacturer_Part_Number: BH1730FVC-TR; RefDes: RefDes; Type: DEV; Supplier 1: Digikey; Supplier Part Number 1: BH1730FVCCT-ND
U15 = CMP-144026-000007-1: CO2 SENSOR 40 PPM I2C SMD
X1#1 = CMP-02115-1: Board Connector, 24 Contact(s), 2 Row(s), Female, Straight, 0.016 inch Pitch, Surface Mount Terminal, Locking, Black Insulator, Receptacle; MIL Conformance: No; Insulation Resistance: 50MR; Durability: 50Cycles; Mating Information: MULTIPLE MATING PARTS AVAILABLE; Rated Current (Signal): 300mA; PCB Contact Pattern: RECTANGULAR; Contact Resistance: 100mR; Body Breadth: 0.18inch; PCB Contact Row Spacing: 4.1656mm; Reference Standard: UL; Reliability: COMMERCIAL; Number Of Connectors: 1; Additional Feature: Low Profile; Number of Rows Loaded: 2; Body Depth: 0.035inch; Number of Contacts: 24; Option: General Purpose; Body Length: 0.234inch; Dielectric Withstanding Voltage (AC): 100V; Termination: SMD/SMT; Mounting Style: STRAIGHT; Contact Finish - Termination: GOLD; Mount: Board; Contact Gender: Female; DIN Conformance: No; Body/Shell Style: RECEPTACLE; Max Operating Temperature: 85°C; Insulation Material: Polymer; Insulation Color: Black; Mixed Contacts: No; Contact Pattern: RECTANGULAR; Connector Type: BOARD CONNECTOR; Contact Finish - Mating: GOLD; Mating Contact Pitch: 0.016inch; RoHS Compliant: Yes; Terminal Pitch: 0.4mm; Mounting Option 1: LOCKING; REACH SVHC: No SVHC; IEC Conformance: No; Flammability Rating: UL94 V-0; JESD-609 Code: e4; Contact Material: Bronze; Filter Feature: No; Number Of PCB Rows: 2; Min Operating Temperature: -35°C
X1#2 = ASCODV-24.000MHz-LR-T3: CONTINUOUS VOLTAGE SMD CRYSTAL OSCILLATOR; Manufacturer_Name: ABRACON; Geometry.Height: 0.8mm; Mouser Part Number: 815-ASCODV-24.00LRT3; Mouser Price/Stock: https://www.mouser.co.uk/ProductDetail/ABRACON/ASCODV-24.000MHz-LR-T3?qs=ulEaXIWI0c%2FIRLeg8YCLgQ%3D%3D; Manufacturer_Part_Number: ASCODV-24.000MHz-LR-T3; Datasheet Link: https://abracon.com/datasheets/ASCODV.pdf; Supplier 1: Digikey; Supplier Part Number 1: 535-ASCODV-24.000MHZ-LR-T3CT-ND
Y1 = CMP-27762-000245-1: XTAL Oscillator 25MHz ±30ppm CMOS 1.8V 4-SMD 3.2mm x 2.5mm; Load Capacitance: 15pF; Max Supply Current: 4mA; Length: 0.126inch; Number of Pins: 4; Series: ASE3; Case/Package: SMD/SMT; Max Operating Temperature: 70°C; Min Operating Temperature: -10°C; Termination: SMD/SMT; Height: 0.049inch; Mount: Surface Mount; Frequency Stability: 30ppm; Lead Free: Lead Free; REACH SVHC: No SVHC; Package Quantity: 1000; Operating Supply Voltage: 1.8V; Width: 0.098inch; Frequency: 25MHz; Packaging: Tape and Reel